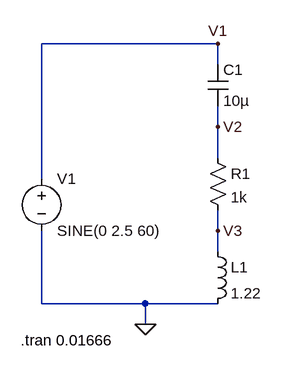
[diagram p0: schematic divisor.asc]
divisor.asc, the LTspice schematic file:
Version 4
SHEET 1 880 680
WIRE 112 -16 -160 -16
WIRE 112 16 112 -16
WIRE 112 112 112 80
WIRE 112 160 112 112
WIRE -160 192 -160 -16
WIRE 112 272 112 240
WIRE 112 304 112 272
WIRE -160 384 -160 272
WIRE 0 384 -160 384
WIRE 112 384 0 384
WIRE 0 416 0 384
FLAG 0 416 0
FLAG 112 -16 V1
FLAG 112 112 V2
FLAG 112 272 V3
SYMBOL voltage -160 176 R0
WINDOW 123 0 0 Left 2
WINDOW 39 0 0 Left 2
SYMATTR InstName V1
SYMATTR Value SINE(0 2.5 60)
SYMBOL cap 96 16 R0
SYMATTR InstName C1
SYMATTR Value 10µ
SYMBOL res 96 144 R0
SYMATTR InstName R1
SYMATTR Value 1k
SYMBOL ind 96 288 R0
SYMATTR InstName L1
SYMATTR Value 1.22
TEXT -192 440 Left 2 !.tran 0.01666

The netlist it stands for:
* divisor.asc
V1 V1 0 SINE(0 2.5 60)
C1 V1 V2 10µ
R1 V2 V3 1k
L1 V3 0 1.22
.tran 0.01666
.backanno
.end